# EAGLE schematic Headphone Amplifier (Fixed) (EAGLE 7.7.0)
AUTHOR: Nathan Campos; REVISION: A
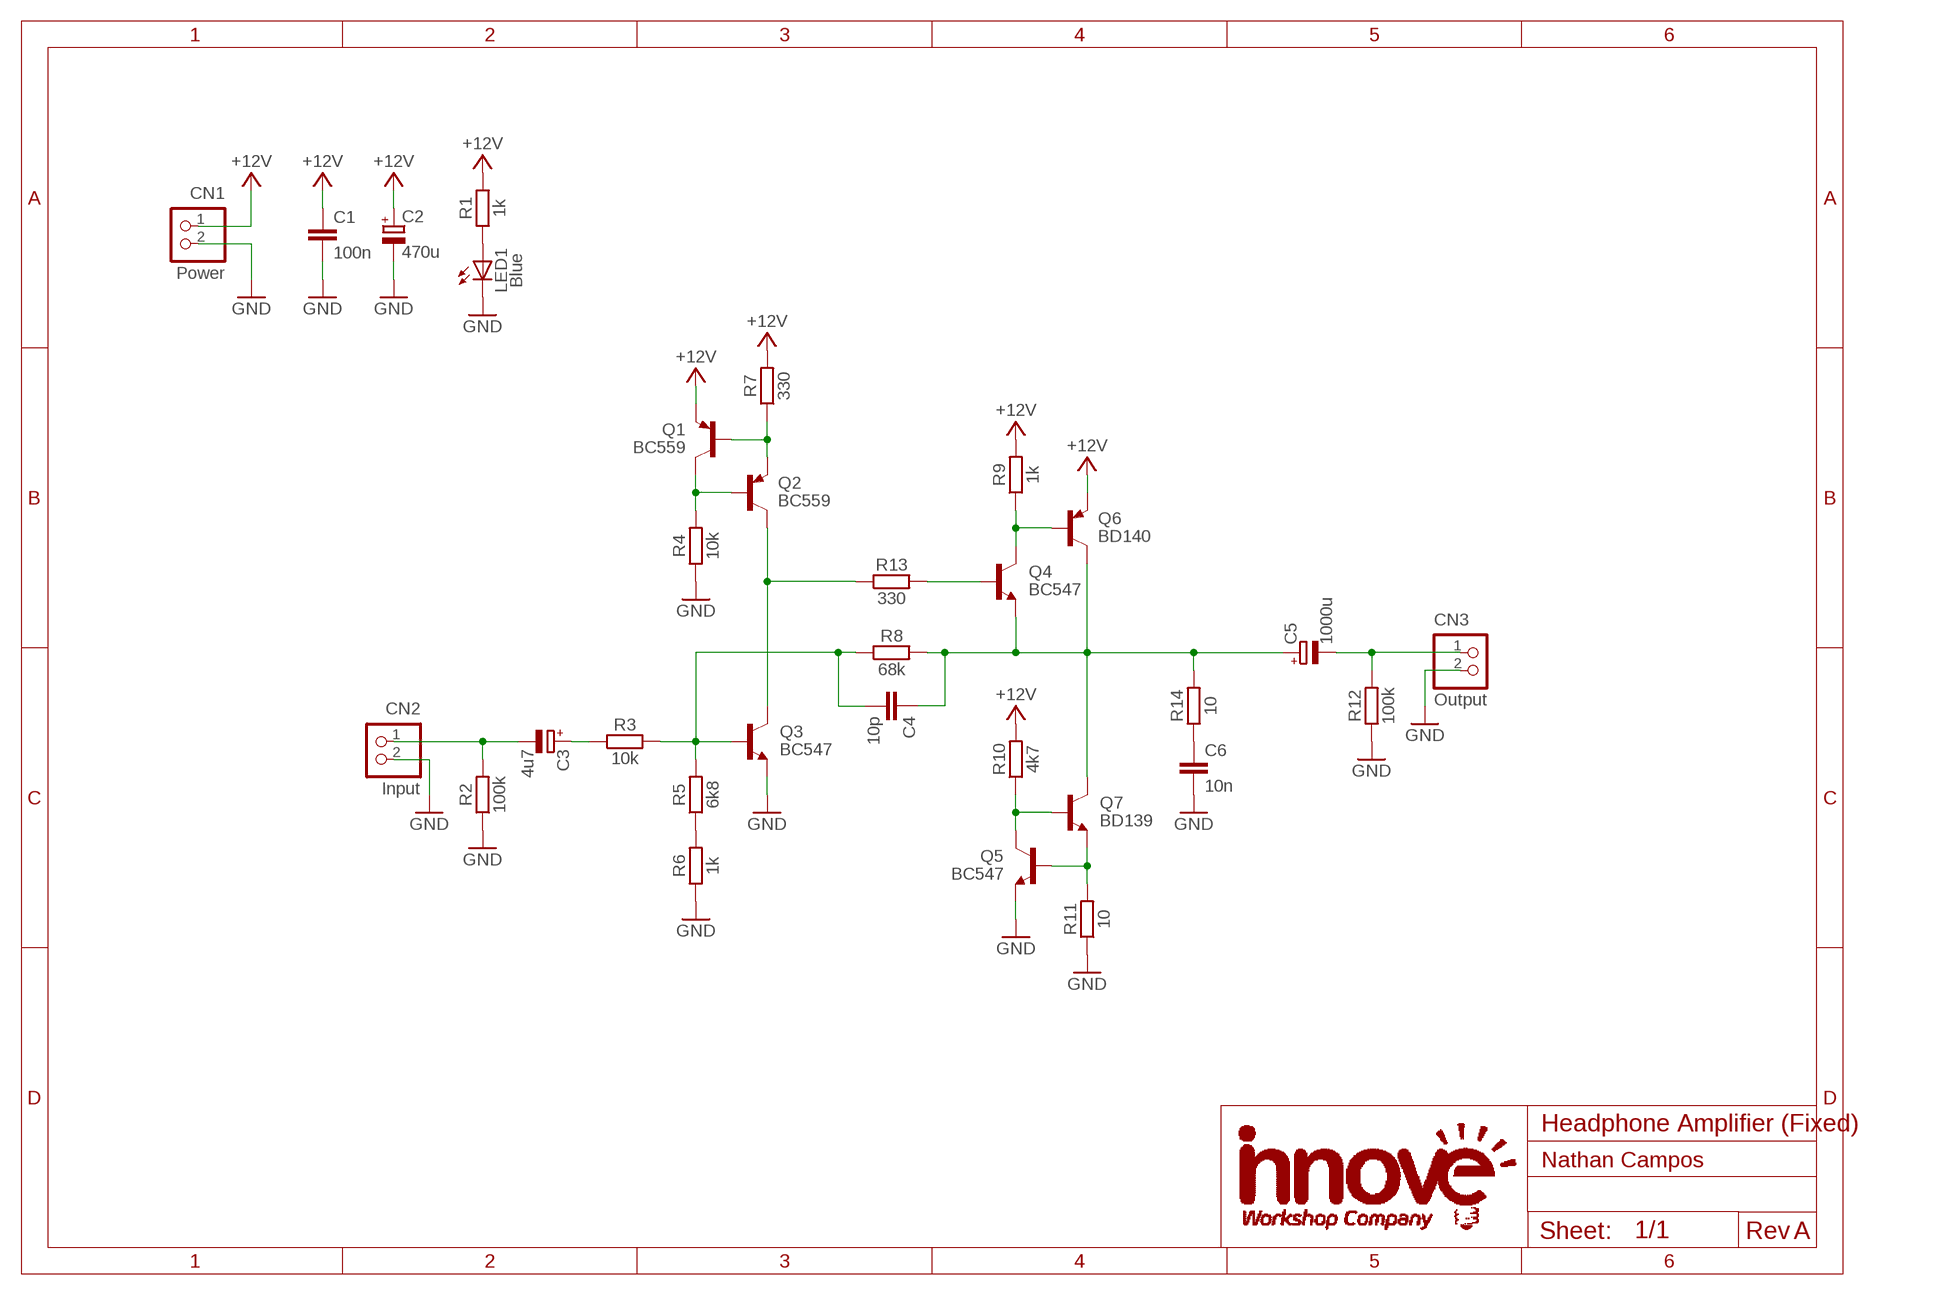
[diagram p0: schematic, sheet 1]

## Parts
C1  100n  C5.0-2.5X7.5  [C050-025X075]
C2  470u  CPOL-E5-10  [E5-10]
C3  4u7  CPOL-E1.8-4  [E1,8-4]
C4  10p  C5.0-2.5X7.5  [C050-025X075]
C5  1000u  CPOL-E5-10  [E5-10]
C6  10n  C5.0-2.5X7.5  [C050-025X075]
CN1  Power  B2B-XH-A  [B2B-XH-A]
CN2  Input  B2B-XH-A  [B2B-XH-A]
CN3  Output  B2B-XH-A  [B2B-XH-A]
LED1  Blue  LED5MM  [LED5MM]
Q1  BC559  [TO92]
Q2  BC559  [TO92]
Q3  BC547  [TO92]
Q4  BC547  [TO92]
Q5  BC547  [TO92]
Q6  BD140  [TO126V]
Q7  BD139  [TO126V]
R1  1k  RT0207  [0207/10]
R2  100k  RT0207  [0207/10]
R3  10k  RT0207  [0207/10]
R4  10k  RT0207  [0207/10]
R5  6k8  RT0207  [0207/10]
R6  1k  RT0207  [0207/10]
R7  330  RT0207  [0207/10]
R8  68k  RT0207  [0207/10]
R9  1k  RT0207  [0207/10]
R10  4k7  RT0207  [0207/10]
R11  10  RT0207  [0207/10]
R12  100k  RT0207  [0207/10]
R13  330  RT0207  [0207/10]
R14  10  RT0207  [0207/10]

## Nets
+12V: C1.1 C2.+ CN1.1 Q1.3(E) Q6.1(E) R1.2 R7.2 R9.2 R10.2
DCOUTPUT: C4.1 C5.+ Q4.3(E) Q6.2(C) Q7.2(C) R8.2 R14.2
GND: C1.2 C2.- C6.2 CN1.2 CN2.2 CN3.2 LED1.K(C) Q3.3(E) Q5.3(E) R2.1 R4.1 R6.1 R11.1 R12.1
INPUT: C3.- CN2.1 R2.2
INTSTAGE: Q2.1(C) Q3.1(C) R13.1
N$1: R5.1 R6.2
N$2: C3.+ R3.1
N$3: LED1.A R1.1
N$4: Q1.1(C) Q2.2(B) R4.2
N$5: Q1.2(B) Q2.3(E) R7.1
N$6: Q4.1(C) Q6.3(B) R9.1
N$7: Q4.2(B) R13.2
N$8: Q5.1(C) Q7.3(B) R10.1
N$9: Q5.2(B) Q7.1(E) R11.2
N$10: C6.1 R14.1
NFB: C4.2 Q3.2(B) R3.2 R5.2 R8.1
OUTPUT: C5.- CN3.1 R12.2

## Library data of the parts
C1 C4 C6 = innove-passives:C: Ceramic Capacitor Those little yellow/brown things
C2 C3 C5 = innove-passives:CPOL: Polarized Capacitor May come in the electrolytic and tantalum variants
CN1-CN3 = innove-con-jst-xh:B2B-XH-A: Wire-to-Board 2.5mm pitch top mount connector Source: http://www.jst-mfg.com/product/pdf/jpn/XH.pdf http://www.jst-mfg.com/product/detail.php?series=277
LED1 = innove-leds:LED: LED OSRAM: - CHIPLED LG R971, LG N971, LY N971, LG Q971, LY Q971, LO R971, LY R971 LH N974, LH R974 LS Q976, LO Q976, LY Q976 LO Q996 - Hyper CHIPLED LW Q18S LB Q993, LB Q99A, LB R99A - SideLED LS A670, LO A670, LY A670, LG A670, LP A670 LB A673, LV A673, LT A673, LW A673 LH A674 LY A675 LS A676, LA A676, LO A676, LY A676, LW A676 LS A679, LY A679, LG A679 - Hyper Micro SIDELED® LS Y876, LA Y876, LO Y876, LY Y876 LT Y87S - SmartLED LW L88C, LW L88S LB L89C, LB L89S, LG L890 LS L89K, LO L89K, LY L89K LS L896, LA L896, LO L896, LY L896 - TOPLED LS T670, LO T670, LY T670, LG T670, LP T670 LSG T670, LSP T670, LSY T670, LOP T670, LYG T670 LG T671, LOG T671, LSG T671 LB T673, LV T673, LT T673, LW T673 LH T674 LS T676, LA T676, LO T676, LY T676, LB T676, LH T676, LSB T676, LW T676 LB T67C, LV T67C, LT T67C, LS T67K, LO T67K, LY T67K, LW E67C LS E67B, LA E67B, LO E67B, LY E67B, LB E67C, LV E67C, LT E67C LW T67C LS T679, LY T679, LG T679 LS T770, LO T770, LY T770, LG T770, LP T770 LB T773, LV T773, LT T773, LW T773 LH T774 LS E675, LA E675, LY E675, LS T675 LS T776, LA T776, LO T776, LY T776, LB T776 LHGB T686 LT T68C, LB T68C - Hyper Mini TOPLED® LB M676 - Mini TOPLED Santana® LG M470 LS M47K, LO M47K, LY M47K Source: http://www.osram.convergy.de LUXEON: - LUMILED® LXK2-PW12-R00, LXK2-PW12-S00, LXK2-PW14-U00, LXK2-PW14-V00 LXK2-PM12-R00, LXK2-PM12-S00, LXK2-PM14-U00 LXK2-PE12-Q00, LXK2-PE12-R00, LXK2-PE12-S00, LXK2-PE14-T00, LXK2-PE14-U00 LXK2-PB12-K00, LXK2-PB12-L00, LXK2-PB12-M00, LXK2-PB14-N00, LXK2-PB14-P00, LXK2-PB14-Q00 LXK2-PR12-L00, LXK2-PR12-M00, LXK2-PR14-Q00, LXK2-PR14-R00 LXK2-PD12-Q00, LXK2-PD12-R00, LXK2-PD12-S00 LXK2-PH12-R00, LXK2-PH12-S00 LXK2-PL12-P00, LXK2-PL12-Q00, LXK2-PL12-R00 Source: www.luxeon.com KINGBRIGHT: KA-3528ASYC Source: www.kingbright.com
Q1 Q2 = innove-bjts:BC559
Q3-Q5 = innove-bjts:BC547
Q6 = innove-bjts:BD140
Q7 = innove-bjts:BD139
R1-R14 = innove-passives:R: Resistor This is officially the most boring component ever.